# Altium schematic sheet Horloge_Oscillator.SchDoc
size A4
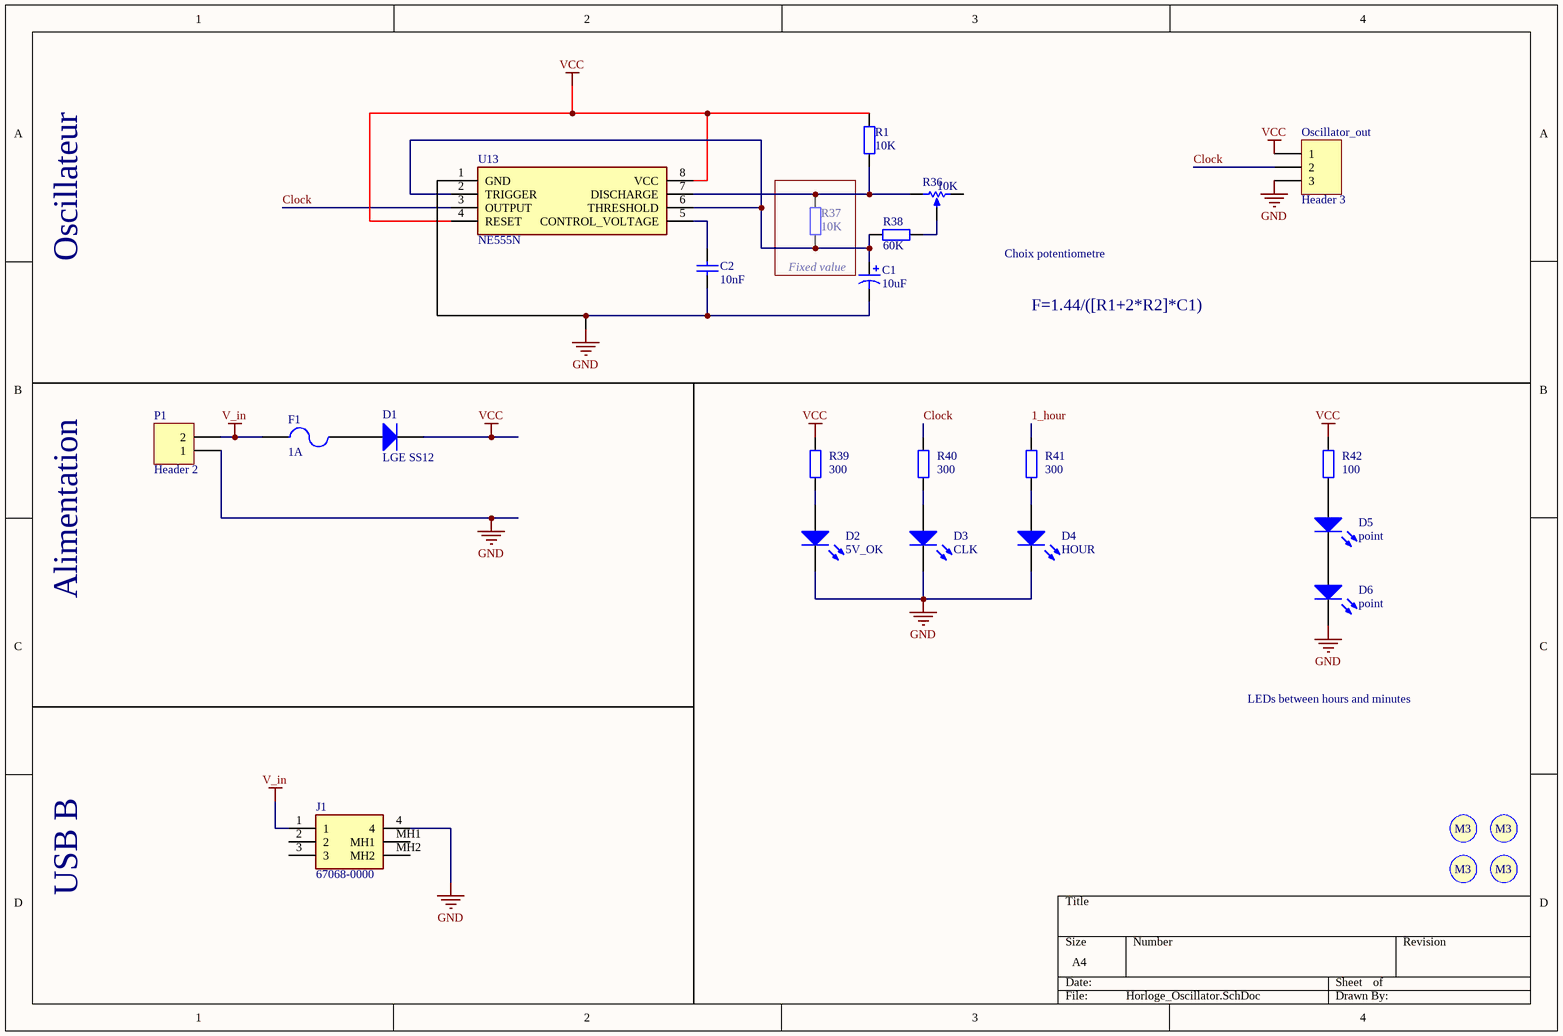
[diagram p0: Horloge_Oscillator.SchDoc]

## Parts
C1  value 10uF  [Capacitor 1206]  (hidden comment: Cap Pol1)
C2  value 10nF  [Capacitor 1206]  (hidden comment: Cap)
D1  LGE SS12  [SMB]
D2  5V_OK  [KP-3216SEC]
D3  CLK  [KP-3216SEC]
D4  HOUR  [KP-3216SEC]
D5  point  [KP-3216SEC]
D6  point  [KP-3216SEC]
F1  1A  [3.5X2.8X1.9]
J1  67068-0000  [670680000]
Oscillator_out  Header 3  [HDR1X3]
P1  Header 2  [HDR1X2]
R1  value 10K  [Resistor 1206]  (hidden comment: Res2)
R36  value 10K  [EVMAASA00B15]  (hidden comment: RPot)
R37  value 10K  [Resistor 1206]  (hidden comment: Res2)
R38  value 60K  [Resistor 1206]  (hidden comment: Res2)
R39  value 300  [Resistor 1206]  (hidden comment: Res2)
R40  value 300  [Resistor 1206]  (hidden comment: Res2)
R41  value 300  [Resistor 1206]  (hidden comment: Res2)
R42  value 100  [Resistor 1206]  (hidden comment: Res2)
S0  Screw M3  [Screw M3]  (value not drawn)
S1  Screw M3  [Screw M3]  (value not drawn)
S2  Screw M3  [Screw M3]  (value not drawn)
S3  Screw M3  [Screw M3]  (value not drawn)
U13  NE555N  [DIP762W56P254L959H533Q8N]

## Blocks framed on the sheet
Fixed value: R37

## Nets
GND: C1.2 C2.1 D2.2(K) D3.2(K) D4.2(K) D6.2(K) J1.4 Oscillator_out.3 P1.1 U13.1(GND)
V_in: F1.2 J1.1 P1.2
VCC: D1.2(K) Oscillator_out.1 R1.1 R39.2 R42.2 U13.4(RESET) U13.8(VCC)
1_hour: R41.2
Clock: Oscillator_out.2 R40.2 U13.3(OUTPUT)
NetC1_1: C1.1 R37.1 R38.2 U13.2(TRIGGER) U13.6(THRESHOLD)
NetC2_2: C2.2 U13.5(CONTROL_VOLTAGE)
NetD1_1: D1.1(A) F1.1
NetD2_1: D2.1(A) R39.1
NetD3_1: D3.1(A) R40.1
NetD4_1: D4.1(A) R41.1
NetD5_1: D5.1(A) R42.1
NetD5_2: D5.2(K) D6.1(A)
NetR1_2: R1.2 R36.1(TOP) R37.2 U13.7(DISCHARGE)
NetR36_3: R36.3(TAP) R38.1

Not connected (* = marked no-connect by the designer): J1 2 3 MH1 MH2; R36 2(BOT)

## Notes on the sheet
- Oscillateur
- Choix potentiometre
- F=1.44/([R1+2*R2]*C1)
- Alimentation
- LEDs between hours and minutes
- USB B
- (in symbol Screw M3) M3

## Library data of the parts
C1 = Cap Pol1: Polarized Capacitor (Radial); Published: 8-Jun-2000; LatestRevisionDate: 17-Jul-2002; LatestRevisionNote: Re-released for DXP Platform.; PackageReference: RB7.6-15; Publisher: Altium Limited; PackageDescription: Polarized Capacitor (Radial); 2 Leads
C2 = Cap: Capacitor; Published: 8-Jun-2000; LatestRevisionDate: 17-Jul-2002; LatestRevisionNote: Re-released for DXP Platform.; PackageReference: RAD-0.3; Publisher: Altium Limited; PackageDescription: Radial Cap, Thru-Hole; 2 Leads; 0.3 in Pin Spacing
D1 = Diode: Default Diode; Published: 8-Jun-2000; LatestRevisionDate: 17-Jul-2002; LatestRevisionNote: Re-released for DXP Platform.; PackageVersion: Sep-1996; PackageReference: SMC; Publisher: Altium Limited; PackageDescription: DO-214-AB/SMC; 2 C-Bend Leads; Body 7.9 x 5.9 mm, inc. leads (LxW); Code_JEDEC: DO-214-AB
D2-D6 = LED2: Typical RED, GREEN, YELLOW, AMBER GaAs LED; Published: 8-Jun-2000; LatestRevisionDate: 17-Jul-2002; LatestRevisionNote: Re-released for DXP Platform.; PackageVersion: Feb-2002; PackageReference: 3.2X1.6X1.1; Publisher: Altium Limited; PackageDescription: SM LED; 2 Flat Leads
F1 = Fuse 2: Fuse; Published: 8-Jun-2000; LatestRevisionDate: 17-Jul-2002; LatestRevisionNote: Re-released for DXP Platform.; PackageReference: PIN-W2/E2.8; Publisher: Altium Limited; PackageDescription: Thru-Hole; 2 Leads
J1 = 67068-0000: Connector; Manufacturer_Name: Molex; Datasheet Link: http://uk.rs-online.com/web/p/products/3248356; Height: 11mm; Manufacturer_Part_Number: 67068-0000; Mouser Part Number: 538-67068-0000; Mouser Price/Stock: https://www.mouser.com/Search/Refine.aspx?Keyword=538-67068-0000
Oscillator_out = Header 3: Header, 3-Pin; LatestRevisionDate: 17-Jul-2002; LatestRevisionNote: Re-released for DXP Platform.; Publisher: Altium Limited
P1 = Header 2: Header, 2-Pin; LatestRevisionDate: 17-Jul-2002; LatestRevisionNote: Re-released for DXP Platform.; Publisher: Altium Limited
R1 R37-R42 = Res2: Resistor; Published: 8-Jun-2000; LatestRevisionDate: 17-Jul-2002; LatestRevisionNote: Re-released for DXP Platform.; PackageReference: AXIAL-0.4; Publisher: Altium Limited; PackageDescription: Axial Device, Thru-Hole; 2 Leads; 0.4 in Pin Spacing
R36 = RPot: Potentiometer; Sim Note: Enter the Resistance value and the set point into parameter fields.; Set Position: 0.5; Published: 8-Jun-2000; LatestRevisionDate: 17-Jul-2002; LatestRevisionNote: Re-released for DXP Platform.; PackageReference: VR5; Publisher: Altium Limited; PackageDescription: Variable Resistor, Thru-Hole; 3 Leads
U13 = NE555N: Integrated Circuit; Manufacturer_Name: ST; Datasheet Link: http://uk.rs-online.com/web/p/products/0305478; Height: 5.33mm; Manufacturer_Part_Number: NE555N; Mouser Part Number: N/A; Mouser Price/Stock: https://www.mouser.com/Search/Refine.aspx?Keyword=N%2FA